# EAGLE design Dist 2.0 (EAGLE 6.2)
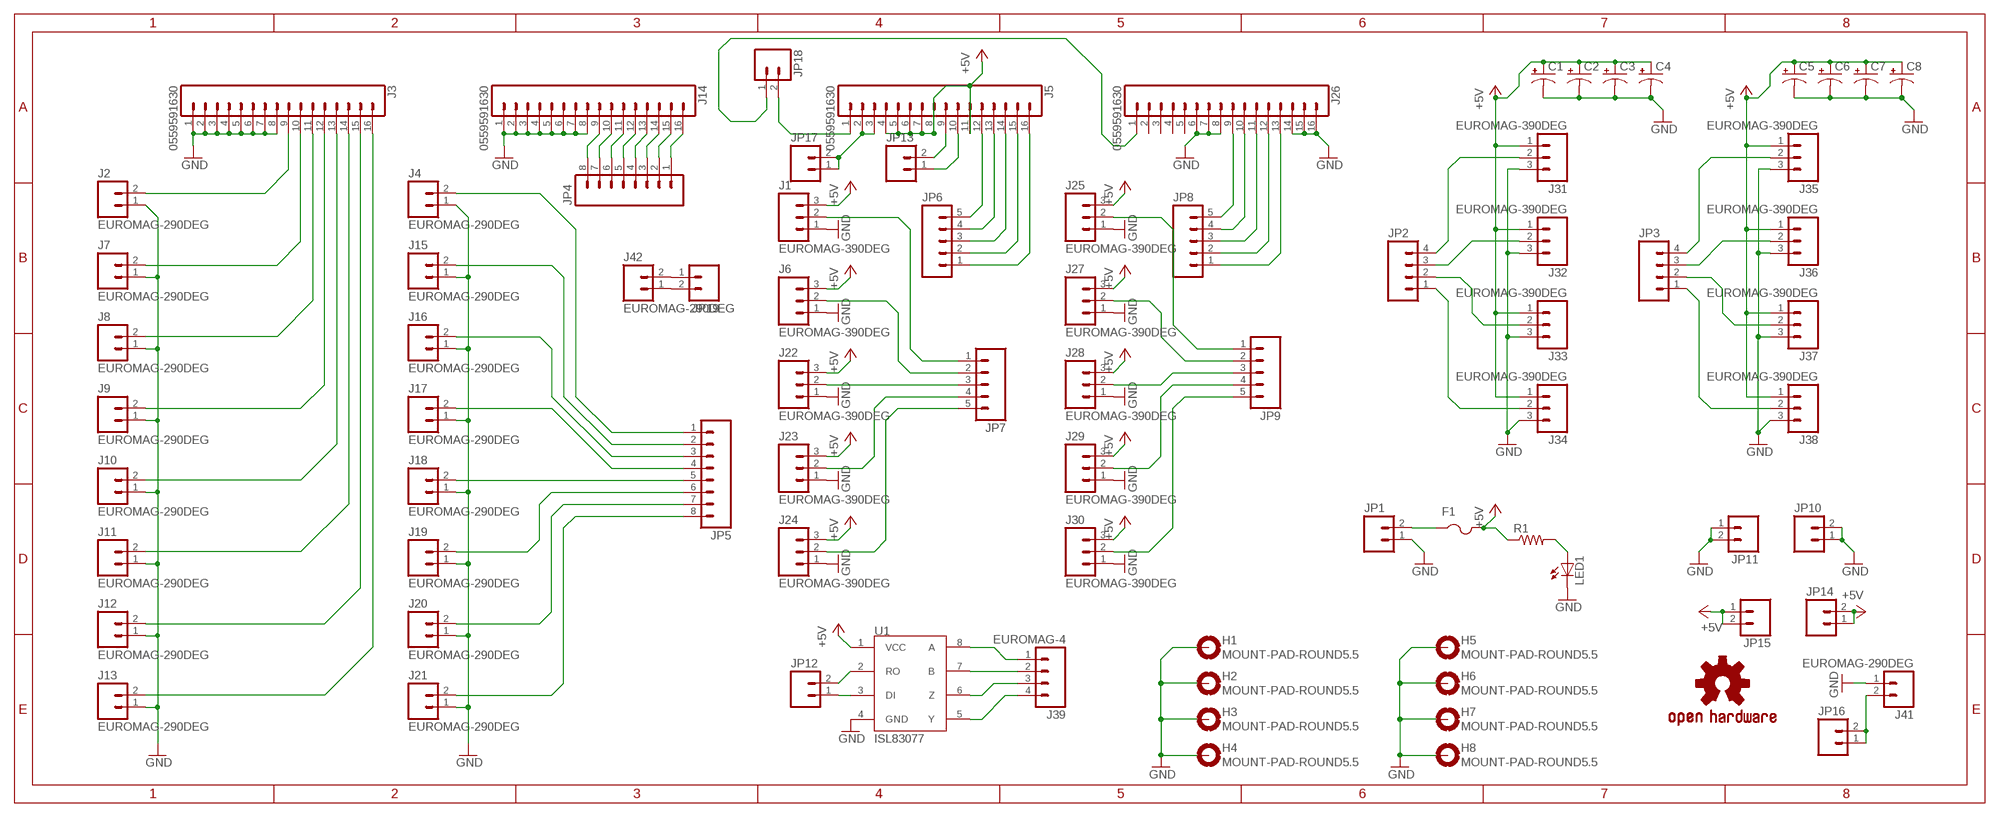
[diagram p0: schematic, sheet 1]

## Parts
C1  CAP_POL3528  [EIA3528]
C2  CAP_POL3528  [EIA3528]
C3  CAP_POL3528  [EIA3528]
C4  CAP_POL3528  [EIA3528]
C5  CAP_POL3528  [EIA3528]
C6  CAP_POL3528  [EIA3528]
C7  CAP_POL3528  [EIA3528]
C8  CAP_POL3528  [EIA3528]
F1  PTCFUSE-1812  [1812]
H1  MOUNT-PAD-ROUND5.5  [5,5-PAD]
H2  MOUNT-PAD-ROUND5.5  [5,5-PAD]
H3  MOUNT-PAD-ROUND5.5  [5,5-PAD]
H4  MOUNT-PAD-ROUND5.5  [5,5-PAD]
H5  MOUNT-PAD-ROUND5.5  [5,5-PAD]
H6  MOUNT-PAD-ROUND5.5  [5,5-PAD]
H7  MOUNT-PAD-ROUND5.5  [5,5-PAD]
H8  MOUNT-PAD-ROUND5.5  [5,5-PAD]
J1  EUROMAG-390DEG  [M3]
J2  EUROMAG-290DEG  [M2]
J3  0559591630  [0559591630]
J4  EUROMAG-290DEG  [M2]
J5  0559591630  [0559591630]
J6  EUROMAG-390DEG  [M3]
J7  EUROMAG-290DEG  [M2]
J8  EUROMAG-290DEG  [M2]
J9  EUROMAG-290DEG  [M2]
J10  EUROMAG-290DEG  [M2]
J11  EUROMAG-290DEG  [M2]
J12  EUROMAG-290DEG  [M2]
J13  EUROMAG-290DEG  [M2]
J14  0559591630  [0559591630]
J15  EUROMAG-290DEG  [M2]
J16  EUROMAG-290DEG  [M2]
J17  EUROMAG-290DEG  [M2]
J18  EUROMAG-290DEG  [M2]
J19  EUROMAG-290DEG  [M2]
J20  EUROMAG-290DEG  [M2]
J21  EUROMAG-290DEG  [M2]
J22  EUROMAG-390DEG  [M3]
J23  EUROMAG-390DEG  [M3]
J24  EUROMAG-390DEG  [M3]
J25  EUROMAG-390DEG  [M3]
J26  0559591630  [0559591630]
J27  EUROMAG-390DEG  [M3]
J28  EUROMAG-390DEG  [M3]
J29  EUROMAG-390DEG  [M3]
J30  EUROMAG-390DEG  [M3]
J31  EUROMAG-390DEG  [M3]
J32  EUROMAG-390DEG  [M3]
J33  EUROMAG-390DEG  [M3]
J34  EUROMAG-390DEG  [M3]
J35  EUROMAG-390DEG  [M3]
J36  EUROMAG-390DEG  [M3]
J37  EUROMAG-390DEG  [M3]
J38  EUROMAG-390DEG  [M3]
J39  EUROMAG-4  [M4]
J41  EUROMAG-290DEG  [M2]
J42  EUROMAG-290DEG  [M2]
JP1  M02POLAR_LOCK  [MOLEX-1X2_LOCK]
JP2  M04POLAR_LOCK  [MOLEX-1X4_LOCK]
JP3  M04POLAR_LOCK  [MOLEX-1X4_LOCK]
JP4  M08LOCK_LONGPADS  [1X08_LOCK_LONGPADS]
JP5  M08LOCK_LONGPADS  [1X08_LOCK_LONGPADS]
JP6  M05LOCK_LONGPADS  [1X05_LOCK_LONGPADS]
JP7  M05LOCK_LONGPADS  [1X05_LOCK_LONGPADS]
JP8  M05LOCK_LONGPADS  [1X05_LOCK_LONGPADS]
JP9  M05LOCK_LONGPADS  [1X05_LOCK_LONGPADS]
JP10  M02PTH  [1X02]
JP11  M02PTH  [1X02]
JP12  M02PTH  [1X02]
JP13  M02PTH  [1X02]
JP14  M02PTH  [1X02]
JP15  M02PTH  [1X02]
JP16  M02PTH  [1X02]
JP17  M02PTH  [1X02]
JP18  M02PTH  [1X02]
JP19  M02PTH  [1X02]
LED1  LEDCHIPLED_0805  [CHIPLED_0805]
R1  R-US_R0805  [R0805]
U1  ISL83077  [SO08]
U$1  OSHW-LOGOL  [OSHW-LOGO-L]

## Nets
+5V: C1.A(+) C2.A(+) C3.A(+) C4.A(+) C5.A(+) C6.A(+) C7.A(+) C8.A(+) F1.2 J1.3 J5.4 J5.5 J5.6 J5.7 J5.8 J5.11 J6.3 J22.3 J23.3 J24.3 J25.3 J27.3 J28.3 J29.3 J30.3 J31.1 J32.1 J33.1 J34.1 J35.1 J36.1 J37.1 J38.1 JP14.1 JP14.2 JP15.1 JP15.2 R1.1 U1.1(VCC)
DI: J5.10 JP13.1
GND: C1.C(-) C2.C(-) C3.C(-) C4.C(-) C5.C(-) C6.C(-) C7.C(-) C8.C(-) H1.B5,5(MOUNT) H2.B5,5(MOUNT) H3.B5,5(MOUNT) H4.B5,5(MOUNT) H5.B5,5(MOUNT) H6.B5,5(MOUNT) H7.B5,5(MOUNT) H8.B5,5(MOUNT) J1.1 J2.1 J3.1 J3.2 J3.3 J3.4 J3.5 J3.6 J3.7 J3.8 J4.1 J6.1 J7.1 J8.1 J9.1 J10.1 J11.1 J12.1 J13.1 J14.1 J14.2 J14.3 J14.4 J14.5 J14.6 J14.7 J14.8 J15.1 J16.1 J17.1 J18.1 J19.1 J20.1 J21.1 J22.1 J23.1 J24.1 J25.1 J26.6 J26.7 J26.8 J26.14 J26.15 J26.16 J27.1 J28.1 J29.1 J30.1 J31.3 J32.3 J33.3 J34.3 J35.3 J36.3 J37.3 J38.3 J41.1 JP1.1 JP10.1 JP10.2 JP11.1 JP11.2 LED1.C U1.4(GND)
N$1: J2.2 J3.9
N$2: J3.10 J7.2
N$3: J3.11 J8.2
N$4: J3.12 J9.2
N$5: J3.13 J10.2
N$6: J3.14 J11.2
N$7: J3.15 J12.2
N$8: J3.16 J13.2
N$9: J26.9 JP8.5
N$10: J14.9 JP4.8
N$11: J4.2 JP5.1
N$12: J14.10 JP4.7
N$13: J14.11 JP4.6
N$14: J14.12 JP4.5
N$15: J14.13 JP4.4
N$16: J14.14 JP4.3
N$17: J14.15 JP4.2
N$18: J26.10 JP8.4
N$19: J26.11 JP8.3
N$20: J26.12 JP8.2
N$21: J26.13 JP8.1
N$22: J14.16 JP4.1
N$23: J5.12 JP6.5
N$24: J5.13 JP6.4
N$25: J5.14 JP6.3
N$26: J5.15 JP6.2
N$27: J5.16 JP6.1
N$28: J15.2 JP5.2
N$29: J5.2 J5.3 JP17.1 JP17.2
N$30: J5.1 JP18.2
N$31: J26.1 JP18.1
N$32: J39.1 U1.8(A)
N$33: J39.2 U1.7(B)
N$34: J39.3 U1.6(Z)
N$35: J39.4 U1.5(Y)
N$36: J16.2 JP5.3
N$37: J17.2 JP5.4
N$38: J18.2 JP5.5
N$39: J19.2 JP5.6
N$40: J20.2 JP5.7
N$41: J21.2 JP5.8
N$42: J1.2 JP7.1
N$43: J6.2 JP7.2
N$44: J22.2 JP7.3
N$45: J23.2 JP7.4
N$46: J24.2 JP7.5
N$47: J31.2 JP2.4
N$48: J32.2 JP2.3
N$49: J33.2 JP2.2
N$50: J34.2 JP2.1
N$51: F1.1 JP1.2
N$52: J35.2 JP3.4
N$53: J36.2 JP3.3
N$54: J37.2 JP3.2
N$55: J38.2 JP3.1
N$56: LED1.A R1.2
N$57: J25.2 JP9.1
N$58: J27.2 JP9.2
N$59: J28.2 JP9.3
N$60: J29.2 JP9.4
N$61: J30.2 JP9.5
N$62: JP12.2 U1.2(RO)
N$63: JP12.1 U1.3(DI)
N$64: J41.2 JP16.1 JP16.2
N$65: J42.2 JP19.1
N$66: J42.1 JP19.2
RO: J5.9 JP13.2
Unconnected: J26.2 J26.3 J26.4 J26.5

## Library data of the parts
C1-C8 = SparkFun:CAP_POL: Capacitor Polarized These are standard SMD and PTH capacitors. Normally 10uF, 47uF, and 100uF in electrolytic and tantalum varieties. Always verify the external diameter of the through hole cap, it varies with capacity, voltage, and manufacturer. The EIA devices should be standard.
F1 = adafruit:PTCFUSE: PTC fuses, resettable thermistors
H1-H8 = holes:MOUNT-PAD-ROUND: MOUNTING PAD, round
J1 J6 J22-J25 J27-J38 = NASA_LIB:EUROMAG-3
J2 J4 J7-J13 J15-J21 J41 J42 = NASA_LIB:EUROMAG-2
J3 J5 J14 J26 = NASA_LIB:0559591630
J39 = NASA_LIB:EUROMAG-4
JP1 = SparkFun:M02: Header 2 Standard 2-pin 0.1" header. Use with straight break away headers (SKU : PRT-00116), right angle break away headers (PRT-00553), swiss pins (PRT-00743), machine pins (PRT-00117), and female headers (PRT-00115). Molex polarized connector foot print use with SKU : PRT-08233 with associated crimp pins and housings.
JP2 JP3 = SparkFun:M04: Header 4 Standard 4-pin 0.1" header. Use with straight break away headers (SKU : PRT-00116), right angle break away headers (PRT-00553), swiss pins (PRT-00743), machine pins (PRT-00117), and female headers (PRT-00115). Molex polarized connector foot print use with SKU : PRT-08231 with associated crimp pins and housings. 1MM SMD Version SKU: PRT-10208
JP4 JP5 = SparkFun:M08: Header 8 Standard 8-pin 0.1" header. Use with straight break away headers (SKU : PRT-00116), right angle break away headers (PRT-00553), swiss pins (PRT-00743), machine pins (PRT-00117), and female headers (PRT-00115).
JP6-JP9 = SparkFun-Connectors:M05: Header 5 Standard 5-pin 0.1" header. Use with straight break away headers (SKU : PRT-00116), right angle break away headers (PRT-00553), swiss pins (PRT-00743), machine pins (PRT-00117), and female headers (PRT-00115). Molex polarized connector foot print use with SKU : PRT-08230 with associated crimp pins and housings.
JP10-JP19 = SparkFun-Connectors:M02: Header 2 Standard 2-pin 0.1" header. Use with straight break away headers (SKU : PRT-00116), right angle break away headers (PRT-00553), swiss pins (PRT-00743), machine pins (PRT-00117), and female headers (PRT-00115). Molex polarized connector foot print use with SKU : PRT-08233 with associated crimp pins and housings.
LED1 = adafruit:LED: LED OSRAM: - CHIPLED LG R971, LG N971, LY N971, LG Q971, LY Q971, LO R971, LY R971 LH N974, LH R974 LS Q976, LO Q976, LY Q976 LO Q996 - Hyper CHIPLED LW Q18S LB Q993, LB Q99A, LB R99A - SideLED LS A670, LO A670, LY A670, LG A670, LP A670 LB A673, LV A673, LT A673, LW A673 LH A674 LY A675 LS A676, LA A676, LO A676, LY A676, LW A676 LS A679, LY A679, LG A679 - Hyper Micro SIDELED® LS Y876, LA Y876, LO Y876, LY Y876 LT Y87S - SmartLED LW L88C, LW L88S LB L89C, LB L89S, LG L890 LS L89K, LO L89K, LY L89K LS L896, LA L896, LO L896, LY L896 - TOPLED LS T670, LO T670, LY T670, LG T670, LP T670 LSG T670, LSP T670, LSY T670, LOP T670, LYG T670 LG T671, LOG T671, LSG T671 LB T673, LV T673, LT T673, LW T673 LH T674 LS T676, LA T676, LO T676, LY T676, LB T676, LH T676, LSB T676, LW T676 LB T67C, LV T67C, LT T67C, LS T67K, LO T67K, LY T67K, LW E67C LS E67B, LA E67B, LO E67B, LY E67B, LB E67C, LV E67C, LT E67C LW T67C LS T679, LY T679, LG T679 LS T770, LO T770, LY T770, LG T770, LP T770 LB T773, LV T773, LT T773, LW T773 LH T774 LS E675, LA E675, LY E675, LS T675 LS T776, LA T776, LO T776, LY T776, LB T776 LHGB T686 LT T68C, LB T68C - Hyper Mini TOPLED® LB M676 - Mini TOPLED Santana® LG M470 LS M47K, LO M47K, LY M47K Source: http://www.osram.convergy.de/
R1 = adafruit:R-US_: RESISTOR, American symbol
U1 = NASA_LIB:ISL83077
U$1 = SparkFun:OSHW-LOGO: Open Source Hardware Logo This logo indicates the piece of hardware it is found on incorporates a OSHW license and/or adheres to the definition of open source hardware found here: http://freedomdefined.org/OSHW

## Board
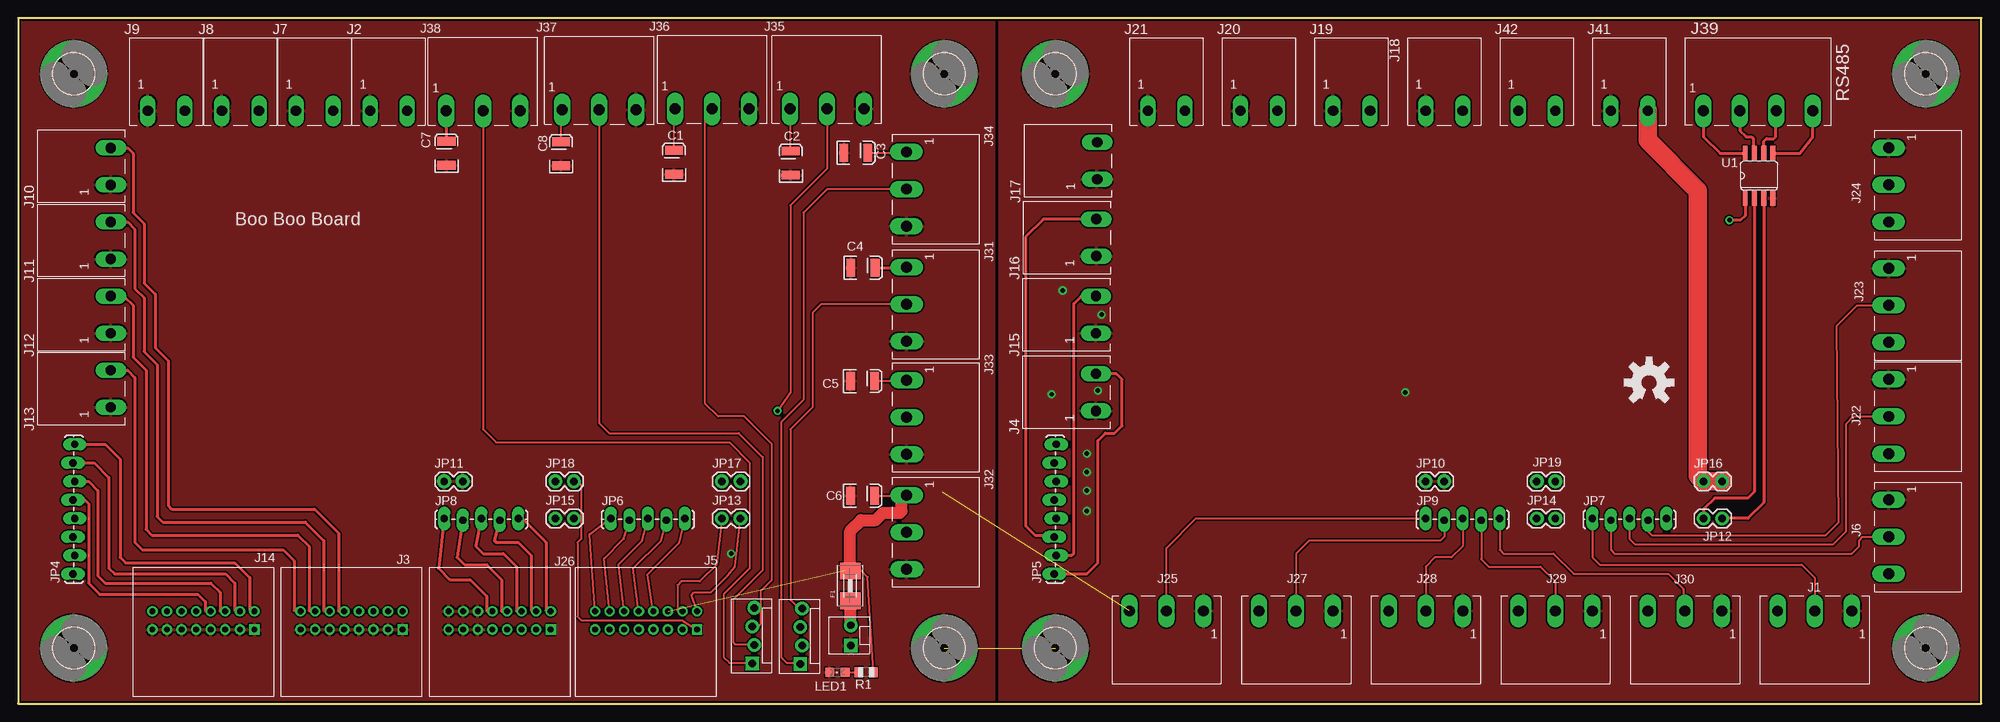
[diagram p1: board, top side]
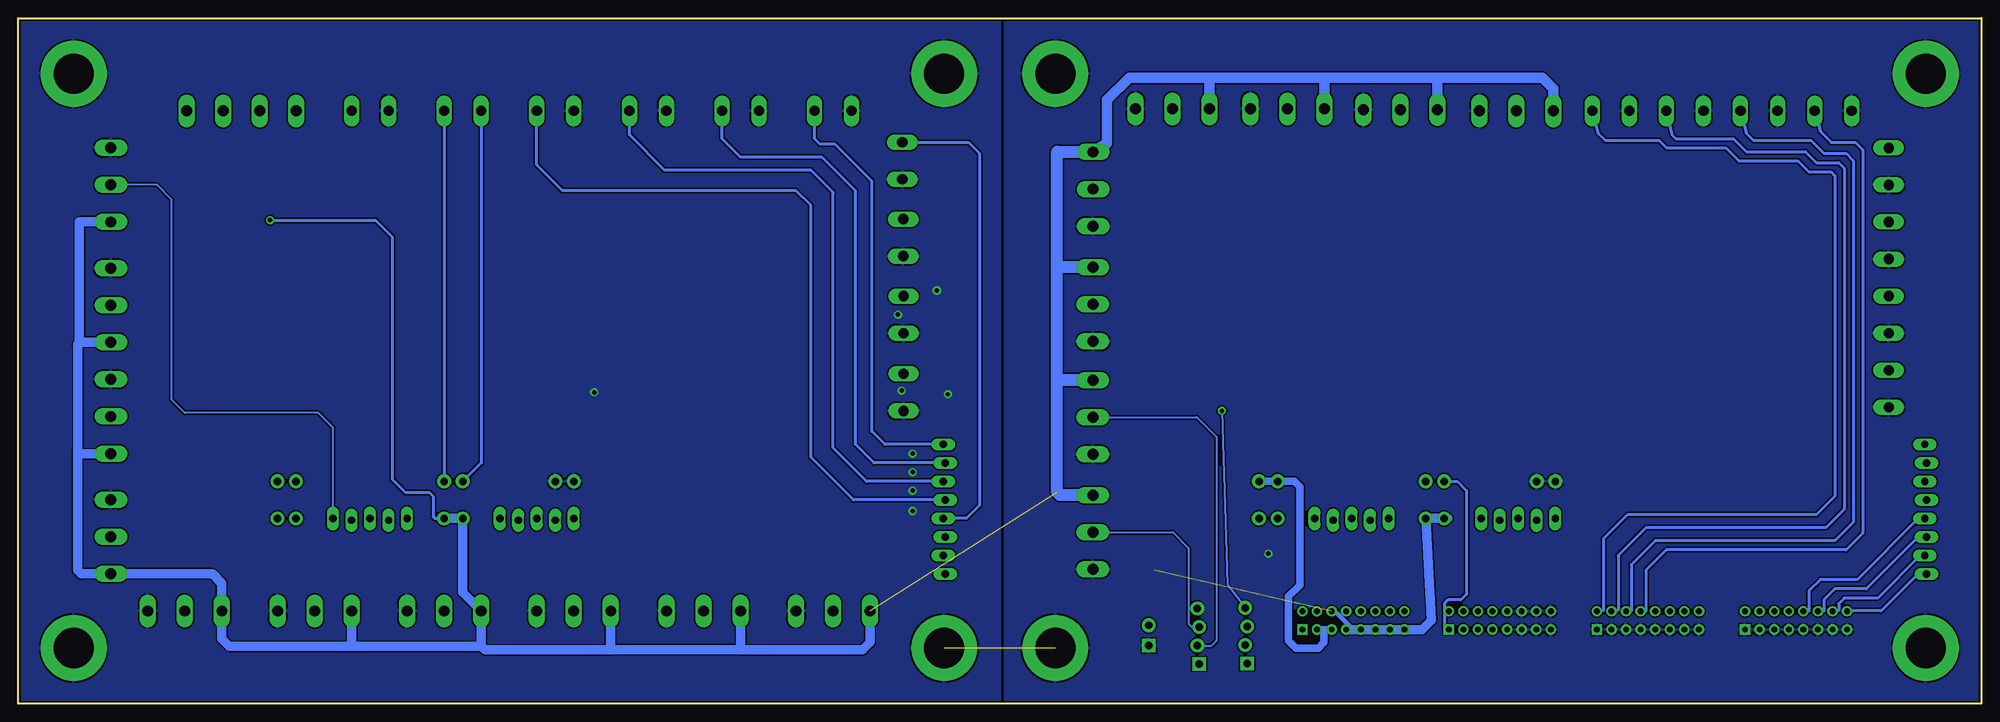
[diagram p2: board, bottom side, seen from below]

Size 269.24 x 93.98 mm. Coordinates in mm from the lower left corner, seen from the top.
Outline: 0,93.98 0,0 269.24,0 269.24,93.98 0,93.98
Copper layers (1*16): Top 0.035mm / dielectric 1.5mm / Bottom 0.035mm
Design rules: minimum track width 8mil, minimum drill 20mil, track to track 8mil, track to pad 8mil, pad to pad 8mil, via to via 8mil, smd to smd 8mil, copper to edge 10mil, drill to drill 8mil, minimum pad ring 12mil, minimum via ring 10mil, stop-mask expansion 4mil, vias tented up to drill 25mil, thermal gap 10mil

### Footprints (pad centres in the part's own frame; a part is rotated, then mirrored left to right if it is on the bottom)
EIA3528 = smd 1.2 x 2.5: A 1.65,0; C -1.65,0
1812 = smd 2.286 x 2.794: 1 -2.046,0; 2 2.046,0
5,5-PAD = drill 5.5 pad 9: B5,5 0,0
M3 = drill 1.5 long: 1 -5.08,0; 2 0,0; 3 5.08,0
M2 = drill 1.4 long: 1 -2.54,0; 2 2.54,0
0559591630 = drill 0.8 square: 1 -7,0 | drill 0.8: 2 -5,0; 3 -3,0; 4 -1,0; 5 1,0; 6 3,0; 7 5,0; 8 7,0; 9 -7,-2.5; 10 -5,-2.5; 11 -3,-2.5; 12 -1,-2.5; 13 1,-2.5; 14 3,-2.5; 15 5,-2.5; 16 7,-2.5
M4 = drill 1.5 long: 1 0,0; 2 5,0; 3 10,0; 4 15,0
MOLEX-1X2_LOCK = drill 1.016 pad 1.88 square: 1 -0.127,0 | drill 1.016 pad 1.88: 2 2.667,0
MOLEX-1X4_LOCK = drill 1.016 pad 1.88 square: 1 0,0.127 | drill 1.016 pad 1.88: 2 2.54,-0.127; 3 5.08,0.127; 4 7.62,-0.127
1X08_LOCK_LONGPADS = drill 1.016 long: 1 0,0.127; 2 2.54,-0.127; 3 5.08,0.127; 4 7.62,-0.127; 5 10.16,0.127; 6 12.7,-0.127; 7 15.24,0.127; 8 17.78,-0.127
1X05_LOCK_LONGPADS = drill 1.016 long: 1 0,0; 2 2.54,-0.254; 3 5.08,0; 4 7.62,-0.254; 5 10.16,0
1X02 = drill 1.016 pad 1.88: 1 0,0; 2 2.54,0
CHIPLED_0805 = smd 1.2 x 1.2: A 0,-1.05; C 0,1.05
R0805 = smd 1.1 x 1.4: 1 -1,0; 2 1,0
SO08 = smd 0.66 x 2.032: 1 -1.905,-3.073; 2 -0.635,-3.073; 3 0.635,-3.073; 4 1.905,-3.073; 5 1.905,3.073; 6 0.635,3.073; 7 -0.635,3.073; 8 -1.905,3.073

### Placement (x,y rotation side)
C1  89.94,74.24 90 top
C2  105.94,74.12 90 top
C3  114.88,75.54 0 top
C4  115.85,59.77 0 top
C5  115.8,44.25 0 top
C6  115.8,28.5 0 top
C7  58.72,75.46 90 top
C8  74.45,75.39 90 top
F1  114.1,16.15 90 top
H1  7.62,7.62 0 top
H2  7.62,86.36 0 top
H3  127,7.62 0 top
H4  127,86.36 0 top
H5  261.62,86.36 0 top
H6  142.24,86.36 0 top
H7  142.24,7.62 0 top
H8  261.62,7.62 0 top
J1  246.38,12.7 180 top
J2  50.8,81.28 0 top
J3  45.72,10.16 180 top
J4  147.83,42.67 90 top
J5  86.11,10.16 180 top
J6  256.54,22.86 270 top
J7  40.64,81.28 0 top
J8  30.48,81.28 0 top
J9  20.32,81.28 0 top
J10  12.7,73.66 90 top
J11  12.7,63.5 90 top
J12  12.7,53.34 90 top
J13  12.7,43.18 90 top
J14  25.4,10.16 180 top
J15  147.83,53.34 90 top
J16  147.85,63.91 90 top
J17  147.98,74.42 90 top
J18  195.58,81.28 0 top
J19  182.88,81.28 0 top
J20  170.18,81.28 0 top
J21  157.48,81.28 0 top
J22  256.54,39.37 270 top
J23  256.54,54.61 270 top
J24  256.54,71.12 270 top
J25  157.48,12.7 180 top
J26  66.04,10.16 180 top
J27  175.26,12.7 180 top
J28  193.04,12.7 180 top
J29  210.82,12.7 180 top
J30  228.6,12.7 180 top
J31  121.84,54.76 270 top
J32  121.84,23.52 270 top
J33  121.84,39.27 270 top
J34  121.82,70.56 270 top
J35  110.92,81.56 0 top
J36  95.17,81.56 0 top
J37  79.68,81.43 0 top
J38  63.75,81.28 0 top
J39  231.14,81.28 0 top
J41  220.98,81.28 0 top
J42  208.28,81.28 0 top
JP1  114.2,8.08 90 top
JP2  107.39,5.44 90 top
JP3  100.81,5.51 90 top
JP4  7.62,17.78 90 top
JP5  142.24,17.78 90 top
JP6  81.28,25.4 0 top
JP7  215.9,25.4 0 top
JP8  58.42,25.4 0 top
JP9  193.04,25.4 0 top
JP10  193.04,30.48 0 top
JP11  58.42,30.48 0 top
JP12  233.68,25.4 180 top
JP13  96.52,25.4 0 top
JP14  208.28,25.4 0 top
JP15  73.66,25.4 0 top
JP16  231.14,30.48 0 top
JP17  96.52,30.48 0 top
JP18  73.66,30.48 0 top
JP19  210.82,30.48 180 top
LED1  112.34,4.29 90 top
R1  116.28,4.29 180 top
U1  238.76,72.39 0 top
U$1  223.67,44.02 0 top

### Tracks (layer width: path | path; a pad name or v marks a point on that pad's centre or on a via)
+5V  (via drill 0.6)  (2 unrouted)
  Top 0.305: C8.A 74.45,80.77 J37.1 | C1.A 89.94,80.9 J36.1 | C3.A 120.95,75.54 J34.1 | C2.A 105.94,80.95 J35.1 | C5.A 120.98,44.25 J33.1 | C6.A 120.98,28.5 J32.1 | R1.1 116.52,17.34 115.57,18.29 113.42,18.29 F1.2
  Top 0.406: U1.1 236.85,66.93 236.22,66.29 v234.7,66.29 | C4.A 121.01,59.77 J31.1 | C7.A 58.73,80.97 J38.1
  Top 1.676: F1.2 114.1,23.67 115.57,25.15 117.6,25.15 118.62,26.16 120.9,26.16 121.16,26.42 121.16,28.52 J32.1
  Bottom 0.406: v234.7,66.29 220.22,66.29 217.93,64.01 217.93,30.73 216.15,28.96 212.85,28.96 212.34,28.45 212.34,25.65 212.09,25.4 210.57,25.4
  Bottom 0.61: J5.11 88.34,12.4 86.11,10.16
  Bottom 1.016: JP15.1 73.15,25.4
  Bottom 1.27: JP14.2 210.57,25.4 JP14.1 208.28,15.24 J29.3 205.74,7.87 | 205.74,7.87 205.23,7.37 187.96,7.37 | 187.96,7.37 J28.3 | J27.3 170.18,7.37 | 170.18,7.37 187.96,7.37 | 170.18,7.37 153.42,7.37 152.4,8.38 J25.3 | J30.3 223.52,7.87 | 223.52,7.87 205.74,7.87 | 223.52,7.87 240.28,7.87 241.3,8.89 J1.3 241.3,16.51 242.57,17.78 J6.3 260.6,17.78 261.11,18.29 261.11,34.29 260.86,34.29 | 260.86,34.29 J22.3 | J23.3 260.86,49.53 | 260.86,49.53 261.11,49.28 261.11,34.54 260.86,34.29 | J24.3 260.86,66.04 260.86,49.53 | 73.15,25.4 JP15.2 75.44,11.43 76.71,10.16 J5.8 J5.7 J5.6 J5.5 86.11,10.16 J5.4
  Bottom 1.422: J35.1 105.84,85.78 105.16,85.85 | 105.16,85.85 116.84,85.85 119.89,82.8 119.89,76.81 J34.1 | J36.1 90.09,85.67 89.15,85.85 | 89.15,85.85 105.16,85.85 | J37.1 74.6,85.67 73.91,85.85 | 73.91,85.85 89.15,85.85 | J38.1 58.67,84.33 60.2,85.85 73.91,85.85
  Bottom 1.676: J32.1 126.39,28.6 126.75,28.96 126.75,44.45 | 126.75,44.45 126.75,59.69 | 126.75,59.69 126.75,75.69 121.11,75.69 J34.1 | J33.1 126.64,44.35 126.75,44.45 | J31.1 126.59,59.84 126.75,59.69
DI
  Top 0.305: JP13.1 95.76,19.05 93.47,16.76 90.93,16.76 90.42,16.26 90.42,12.74 J5.10
GND  (via drill 0.6)  (1 unrouted)
  other vias: 141.73,42.42 148.08,42.93 146.56,34.29 146.56,31.75 146.56,29.21 146.56,26.42 148.59,53.34 143.26,56.64 190.25,42.67 97.79,20.57
  pour Bottom: -0.76,0 133.86,0 133.86,93.98 -0.76,93.98
  pour Top: -0.76,0 133.86,0 133.86,93.98 -0.76,93.98
  pour Top: 134.62,93.98 269.24,93.98 269.24,0 134.62,0
  pour Bottom: 134.62,93.98 269.24,93.98 269.24,0 134.62,0
N$1
  Bottom 0.406: J2.2 52.58,78.23 51.56,77.22 44.2,77.22 43.18,76.2 35.05,76.2 33.27,74.42 25.15,74.42 23.62,72.9 20.57,72.9 20.07,72.39 20.07,28.45 22.61,25.91 48.51,25.91 51.82,22.61 51.82,12.8 J3.9
N$2
  Bottom 0.406: J7.2 42.42,77.98 41.91,77.47 34.04,77.47 32.26,75.69 24.13,75.69 22.61,74.17 19.56,74.17 18.8,73.41 18.8,26.67 21.34,24.13 45.97,24.13 49.78,20.32 49.78,12.83 J3.10
N$3
  Bottom 0.406: J8.2 32.26,78.23 31.24,77.22 23.37,77.22 21.59,75.44 18.54,75.44 17.53,74.42 17.53,24.89 20.07,22.35 44.7,22.35 48.01,19.05 48.01,12.71 J3.11
N$4
  Bottom 0.406: J9.2 22.1,78.49 20.57,76.96 17.27,76.96 16.26,75.95 16.26,23.37 18.54,21.08 43.18,21.08 45.97,18.29 45.97,12.68 J3.12
N$5
  Top 0.406: J10.2 14.99,76.2 15.75,75.44 15.75,67.31 17.27,65.79 17.27,57.66 18.8,56.13 18.8,48.77 20.57,46.99 20.57,27.18 21.08,26.67 40.64,26.67 43.94,23.37 43.94,12.68 J3.13
N$6
  Top 0.406: J11.2 14.99,66.04 16,65.02 16,56.9 17.27,55.63 17.27,48.26 19.05,46.48 19.05,25.65 19.81,24.89 39.37,24.89 41.91,22.35 41.91,12.71 J3.14
N$7
  Top 0.406: J12.2 14.48,55.88 15.75,54.61 15.75,47.5 17.53,45.72 17.53,23.88 18.29,23.11 38.35,23.11 39.88,21.59 39.88,12.74 J3.15
N$8
  Top 0.406: J13.2 14.99,45.72 16,44.7 16,22.1 17.02,21.08 36.32,21.08 37.85,19.56 37.85,12.77 J3.16
N$9
  Top 0.406: JP8.5 69.09,25.4 72.39,22.1 72.39,12.77 J26.9
N$10
  Top 0.406: JP4.8 11.94,35.56 13.97,33.53 13.97,20.07 14.73,19.3 29.72,19.3 31.75,17.27 31.75,12.77 J14.9
N$11
  Top 0.406: JP5.1 146.56,17.78 148.08,19.3 148.08,36.07 149.1,37.08 150.37,37.08 151.38,38.1 151.38,44.45 150.62,45.21 J4.2
N$12
  Top 0.406: JP4.7 10.41,33.02 12.45,30.99 12.45,18.54 13.21,17.78 28.45,17.78 29.72,16.51 29.72,12.74 J14.10
N$13
  Top 0.406: JP4.6 9.65,30.48 10.92,29.21 10.92,17.53 11.94,16.51 26.42,16.51 27.69,15.24 27.69,12.71 J14.11
N$14
  Top 0.406: JP4.5 9.14,27.94 9.65,27.43 9.65,16.51 11.18,14.99 24.64,14.99 25.65,13.97 25.65,12.68 J14.12
N$15
  Bottom 0.406: JP4.4 8.64,25.4 17.02,17.02 22.1,17.02 23.62,15.49 23.62,12.68 J14.13
N$16
  Bottom 0.406: JP4.3 8.64,22.86 15.75,15.75 20.07,15.75 21.59,14.22 21.59,12.71 J14.14
N$17
  Bottom 0.406: JP4.2 8.38,20.32 14.22,14.48 18.8,14.48 19.56,13.72 19.56,12.74 J14.15
N$18
  Top 0.406: JP8.4 65.28,22.35 65.53,22.1 68.58,22.1 70.36,20.32 70.36,12.74 J26.10
N$19
  Top 0.406: JP8.3 62.74,21.59 63.75,20.57 66.55,20.57 68.33,18.8 68.33,12.71 J26.11
N$20
  Top 0.406: JP8.2 60.2,20.07 61.21,19.05 64.26,19.05 66.29,17.02 66.29,12.68 J26.12
N$21
  Top 0.406: JP8.1 57.66,18.54 59.18,17.02 61.98,17.02 64.26,14.73 64.26,12.68 J26.13
N$22
  Bottom 0.406: JP4.1 8.64,17.78 13.72,12.7 17.6,12.7 J14.16
N$23
  Top 0.305: J5.12 86.34,17.76 90.68,22.1 JP6.5
N$24
  Top 0.305: J5.13 84.34,18.56 88.14,22.35 JP6.4
N$25
  Top 0.305: J5.14 82.34,19.1 85.6,22.35 JP6.3
N$26
  Top 0.305: J5.15 80.34,19.89 83.06,22.61 JP6.2
N$27
  Top 0.305: J5.16 78.34,23.23 JP6.1
N$28
  Top 0.406: JP5.2 144.53,20.32 144.78,20.57 144.78,54.86 145.8,55.88 J15.2
N$29
  Bottom 1.016: JP17.2 JP17.1 94.23,30.48 93.47,29.72 93.47,16.26 95,14.73 95,8.64 93.98,7.62 90.93,7.62 90.17,8.38 90.17,9.99 J5.2 J5.3
N$30
  Top 0.305: JP18.2 76.71,30.48 77.22,29.97 77.22,22.61 76.71,22.1 76.71,11.94 77.22,11.43 91.07,11.43 J5.1
N$31
  Bottom 0.406: JP18.1 71.88,30.48 70.61,29.21 70.61,14.99 71.37,14.22 73.15,14.22 73.66,13.72 73.66,10.67 73.15,10.16 J26.1
N$32
  Top 0.406: J39.1 231.14,77.72 233.43,75.44 236.83,75.44 U1.8
N$33
  Top 0.406: J39.2 236.14,78.57 236.98,77.72 237.74,77.72 238,77.47 238,75.59 U1.7
N$34
  Top 0.406: U1.6 239.4,77.09 239.78,77.47 240.79,77.47 241.05,77.72 241.05,81.19 J39.3
N$35
  Top 0.406: U1.5 244.37,75.46 246.13,77.72 246.13,81.27 J39.4
N$36
  Top 0.406: J16.2 140.61,66.45 138.18,64.01 138.18,24.38 139.45,23.11 141.86,23.11 JP5.3
N$37
  Bottom 0.406: J17.2 138.94,76.96 137.41,75.44 137.41,27.18 139.19,25.4 JP5.4
N$38
  Bottom 0.406: JP5.5 154.69,27.94 160.53,33.78 160.53,68.33 162.56,70.36 194.56,70.36 198.12,73.91 J18.2
N$39
  Bottom 0.406: JP5.6 152.91,30.48 157.48,35.05 157.48,70.1 160.53,73.15 180.59,73.15 185.42,77.98 J19.2
N$40
  Bottom 0.406: JP5.7 151.89,33.02 154.43,35.56 154.43,70.36 159,74.93 170.18,74.93 172.72,77.47 J20.2
N$41
  Bottom 0.406: JP5.8 150.37,35.56 152.15,37.34 152.15,71.63 157.23,76.71 159.26,76.71 160.02,77.47 J21.2
N$42
  Top 0.305: JP7.1 215.9,20.07 216.92,19.05 244.6,19.05 246.38,17.27 J1.2
N$43
  Top 0.305: JP7.2 218.44,21.08 218.95,20.57 251.46,20.57 252.48,21.59 252.48,22.35 252.98,22.86 J6.2
N$44
  Top 0.305: JP7.3 220.98,22.61 221.74,21.84 248.92,21.84 250.7,23.62 250.7,38.35 251.71,39.37 J22.2
N$45
  Top 0.305: JP7.4 223.52,23.62 224.03,23.11 247.9,23.11 249.68,24.89 249.43,51.82 252.22,54.61 J23.2
N$46
  Bottom 0.305: JP7.5 226.06,37.85 228.09,39.88 246.38,39.88 248.16,41.66 248.16,69.09 250.19,71.12 J24.2
N$47
  Top 0.254: J31.2 110.13,54.76 108.97,53.59 108.97,40.64 105.92,37.59 105.92,14.22 106.68,13.46 106.68,13.13 JP2.4
N$48
  Bottom 0.254: J32.2 110.9,23.52 108.71,21.34 108.71,10.92 108.2,10.41 106.6,10.41 JP2.3
N$49
  Bottom 0.254: J33.2 107.59,39.27 104.9,36.58 104.9,8.64 105.66,7.87 106.66,7.87 JP2.2
N$50
  Top 0.254: J34.2 110.95,70.56 107.7,67.31 107.7,41.66 104.65,38.61 104.65,6.35 105.41,5.59 106.35,5.59 JP2.1
N$51
  Top 1.676: F1.1 114.1,11.35 JP1.2
N$52  (via drill 0.6)
  Top 0.254: v104.14,40.13 105.92,42.67 105.92,68.33 111,73.41 111,81.48 J35.2
  Bottom 0.254: v104.14,40.13 103.38,16.33 JP3.4
N$53
  Top 0.254: JP3.3 101.52,10.59 101.85,10.92 101.85,15.49 103.38,17.02 103.38,35.56 99.57,39.37 96.01,39.37 94.23,41.15 94.23,81.38 J36.2
N$54
  Top 0.254: J37.2 79.68,38.43 81.03,37.08 98.81,37.08 102.11,33.78 102.11,18.29 98.04,14.22 98.04,8.38 98.3,8.13 100.1,8.13 JP3.2
N$55
  Top 0.254: J38.2 63.75,37.59 65.53,35.81 97.54,35.81 100.33,33.02 100.33,18.54 96.77,14.99 96.77,6.35 97.54,5.59 99.85,5.59 JP3.1
N$56
  Top 0.305: LED1.A R1.2
N$57
  Top 0.305: J25.2 157.48,21.34 161.54,25.4 JP9.1
N$58
  Top 0.305: JP9.2 195.58,22.86 195.07,22.35 177.04,22.35 175.26,20.57 J27.2
N$59
  Top 0.305: JP9.3 198.12,21.59 196.6,20.07 194.31,20.07 193.04,18.8 J28.2
N$60
  Top 0.305: JP9.4 200.66,19.81 201.68,18.8 208.79,18.8 210.82,16.76 J29.2
N$61
  Top 0.305: JP9.5 203.2,21.08 203.71,20.57 210.57,20.57 213.36,17.78 226.31,17.78 228.35,15.75 228.35,12.95 J30.2
N$62
  Top 0.406: U1.2 238.12,29.08 237.24,28.19 232.66,28.19 231.14,26.67 JP12.2
N$63
  Top 0.406: U1.3 239.4,27.56 237.24,25.4 JP12.1
N$64
  Top 2.54: J41.2 223.52,77.22 230.38,70.36 230.38,31.24 JP16.1 JP16.2
N$65
  Bottom 0.406: J42.2 JP19.1
N$66
  Bottom 0.406: J42.1 205.74,33.02 JP19.2
RO
  Top 0.305: J5.9 92.34,14.87 92.71,15.24 95,15.24 97.28,17.53 98.3,18.8 JP13.2

### Text on the board
tPlace: RS485 | Boo Boo Board
tOrigins: RJ